# EAGLE design CTU (EAGLE 6.2)
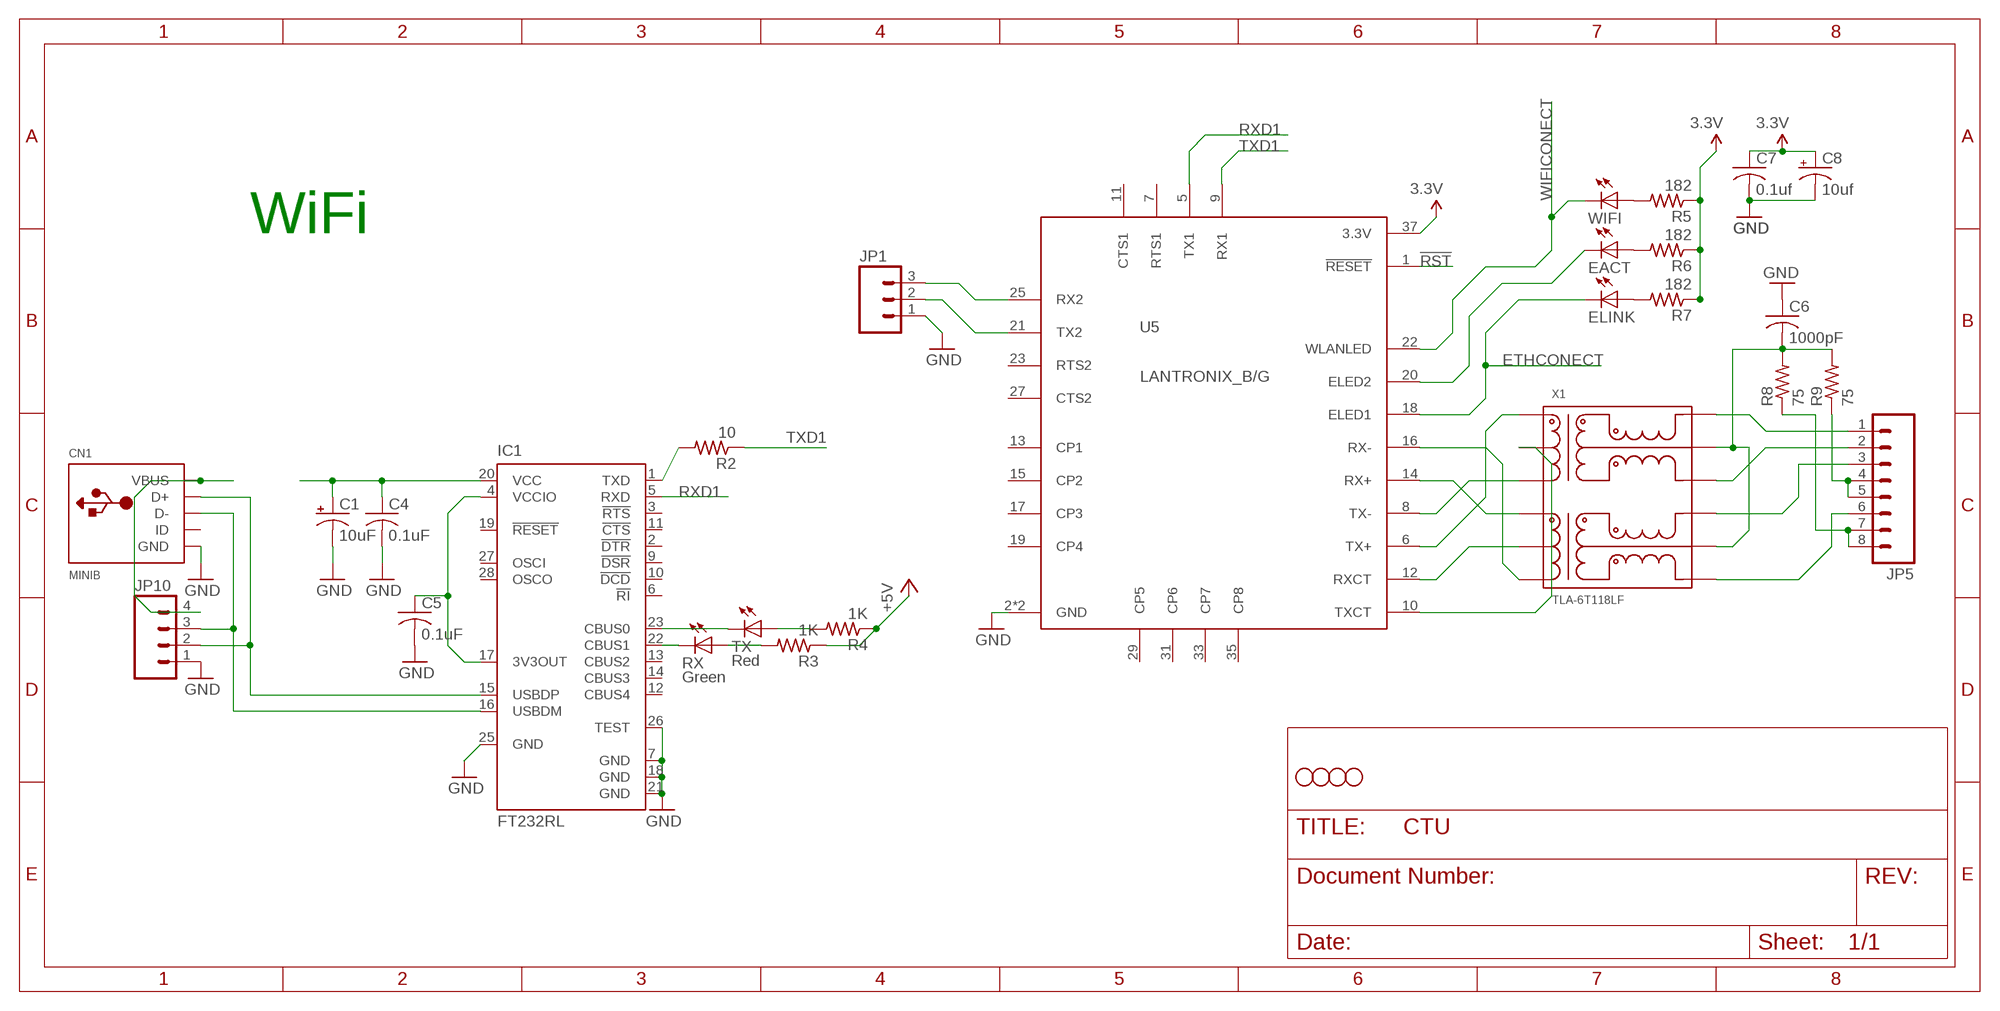
[diagram p0: schematic, sheet 1]

## Parts
C1  10uF  CAP_POL3528-KIT  [EIA3528-KIT]
C4  0.1uF  C-USC0805K  [C0805K]
C5  0.1uF  C-USC0805K  [C0805K]
C6  1000pF  C-USC1812  [C1812]
C7  0.1uf  C-USC0805K  [C0805K]
C8  10uf  CAP_POL3528  [EIA3528]
CN1  MINIB  USBMINIB  [USB-MINIB]
EACT  LEDCHIP-LED0805  [CHIP-LED0805]
ELINK  LEDCHIP-LED0805  [CHIP-LED0805]
IC1  FT232RL  [SSOP28]
JP1  M03POLAR  [MOLEX-1X3]
JP2  STAND-OFF  [STAND-OFF]
JP3  STAND-OFF  [STAND-OFF]
JP4  STAND-OFF  [STAND-OFF]
JP5  M08LOCK_LONGPADS  [1X08_LOCK_LONGPADS]
JP6  STAND-OFF  [STAND-OFF]
JP10  M04POLAR  [MOLEX-1X4]
R2  10  R-US_R0805  [R0805]
R3  1K  R-US_R0805  [R0805]
R4  1K  R-US_R0805  [R0805]
R5  182  R-US_R0805  [R0805]
R6  182  R-US_R0805  [R0805]
R7  182  R-US_R0805  [R0805]
R8  75  R-US_R0805  [R0805]
R9  75  R-US_R0805  [R0805]
RX  Green  LEDCHIP-LED0805  [CHIP-LED0805]
TX  Red  LEDCHIP-LED0805  [CHIP-LED0805]
U5  LANTRONIX_B/G  LANTRONIX_A/B  [LANA/BTH]
WIFI  LEDCHIP-LED0805  [CHIP-LED0805]
X1  TLA-6T118LF  [SO-16MOD]

## Nets
3.3V: C7.1 C8.A(+) R5.1 R6.1 R7.1 U5.37(3.3V)
!RST: U5.1(!RESET)
+5V: R3.1 R4.1
ETHCONECT: ELINK.C U5.18(ELED1)
GND: C1.C(-) C4.2 C5.2 C6.1 C7.2 C8.C(-) CN1.GND IC1.7(GND) IC1.18(GND) IC1.21(GND) IC1.25(GND) IC1.26(TEST) JP1.1 JP10.1 U5.2(GND) U5.39(GND)
N$1: JP1.2 U5.21(TX2)
N$2: JP1.3 U5.25(RX2)
N$3: C1.A(+) C4.1 IC1.20(VCC)
N$5: CN1.D+ IC1.15(USBDP) JP10.2
N$8: CN1.D- IC1.16(USBDM) JP10.3
N$22: IC1.23(CBUS0) TX.C
N$24: IC1.22(CBUS1) RX.C
N$30: R3.2 RX.A
N$31: R4.2 TX.A
N$32: IC1.1(TXD) R2.2
N$34: C5.1 IC1.4(VCCIO) IC1.17(3V3OUT)
N$53: U5.8(TX-) X1.3
N$54: U5.6(TX+) X1.1
N$55: U5.14(RX+) X1.6
N$56: U5.16(RX-) X1.8
N$57: U5.12(RXCT) X1.7
N$58: U5.10(TXCT) X1.2
N$59: JP5.4 JP5.5 R9.1
N$60: JP5.7 JP5.8 R8.1
N$61: JP5.6 X1.9
N$62: JP5.3 X1.11
N$63: JP5.2 X1.14
N$64: JP5.1 X1.16
N$65: C6.2 R8.2 R9.2 X1.10 X1.15
N$66: ELINK.A R7.2
N$67: EACT.A R6.2
N$68: R5.2 WIFI.A
N$70: EACT.C U5.20(ELED2)
RXD1: IC1.5(RXD) U5.5(TX1)
TXD1: R2.1 U5.9(RX1)
VBUS: CN1.VBUS JP10.4
WIFICONECT: U5.22(WLANLED) WIFI.C
Unconnected: CN1.ID IC1.2(!DTR) IC1.3(!RTS) IC1.6(!RI) IC1.9(!DSR) IC1.10(!DCD) IC1.11(!CTS) IC1.12(CBUS4) IC1.13(CBUS2) IC1.14(CBUS3) IC1.19(!RESET) IC1.27(OSCI) IC1.28(OSCO) U5.7(RTS1) U5.11(CTS1) U5.13(CP1) U5.15(CP2) U5.17(CP3) U5.19(CP4) U5.23(RTS2) U5.27(CTS2) U5.29(CP5) U5.31(CP6) U5.33(CP7) U5.35(CP8)

## Notes on the sheet
- WiFi

## Library data of the parts
C1 C8 = SparkFun:CAP_POL: Capacitor Polarized These are standard SMD and PTH capacitors. Normally 10uF, 47uF, and 100uF in electrolytic and tantalum varieties. Always verify the external diameter of the through hole cap, it varies with capacity, voltage, and manufacturer. The EIA devices should be standard.
C4-C7 = adafruit:C-US: CAPACITOR, American symbol
CN1 = adafruit:USB: USB Connectors USBMINIB - Surface Mount Female Mini-B USB Connector 4UConnector: 06564 By microbuilder.eu Thru-hole RA Female Mini-B USB Connector 4UConnector: 18732 By ladyada.net
EACT ELINK RX TX WIFI = adafruit:LED: LED OSRAM: - CHIPLED LG R971, LG N971, LY N971, LG Q971, LY Q971, LO R971, LY R971 LH N974, LH R974 LS Q976, LO Q976, LY Q976 LO Q996 - Hyper CHIPLED LW Q18S LB Q993, LB Q99A, LB R99A - SideLED LS A670, LO A670, LY A670, LG A670, LP A670 LB A673, LV A673, LT A673, LW A673 LH A674 LY A675 LS A676, LA A676, LO A676, LY A676, LW A676 LS A679, LY A679, LG A679 - Hyper Micro SIDELED® LS Y876, LA Y876, LO Y876, LY Y876 LT Y87S - SmartLED LW L88C, LW L88S LB L89C, LB L89S, LG L890 LS L89K, LO L89K, LY L89K LS L896, LA L896, LO L896, LY L896 - TOPLED LS T670, LO T670, LY T670, LG T670, LP T670 LSG T670, LSP T670, LSY T670, LOP T670, LYG T670 LG T671, LOG T671, LSG T671 LB T673, LV T673, LT T673, LW T673 LH T674 LS T676, LA T676, LO T676, LY T676, LB T676, LH T676, LSB T676, LW T676 LB T67C, LV T67C, LT T67C, LS T67K, LO T67K, LY T67K, LW E67C LS E67B, LA E67B, LO E67B, LY E67B, LB E67C, LV E67C, LT E67C LW T67C LS T679, LY T679, LG T679 LS T770, LO T770, LY T770, LG T770, LP T770 LB T773, LV T773, LT T773, LW T773 LH T774 LS E675, LA E675, LY E675, LS T675 LS T776, LA T776, LO T776, LY T776, LB T776 LHGB T686 LT T68C, LB T68C - Hyper Mini TOPLED® LB M676 - Mini TOPLED Santana® LG M470 LS M47K, LO M47K, LY M47K Source: http://www.osram.convergy.de/
IC1 = ftdichip:FT232R: Source: http://www.ftdichip.com/Documents/DataSheets/DS_FT232R_v104.pdf
JP1 = SparkFun:M03: Header 3 Standard 3-pin 0.1" header. Use with straight break away headers (SKU : PRT-00116), right angle break away headers (PRT-00553), swiss pins (PRT-00743), machine pins (PRT-00117), and female headers (PRT-00115). Molex polarized connector foot print use with SKU : PRT-08232 with associated crimp pins and housings.
JP2-JP4 JP6 = SparkFun:STAND-OFF: Stand Off This is the mechanical footprint for a #4 phillips button head screw. Use the keepout ring to avoid running the screw head into surrounding components. SKU : PRT-00447
JP5 = SparkFun:M08: Header 8 Standard 8-pin 0.1" header. Use with straight break away headers (SKU : PRT-00116), right angle break away headers (PRT-00553), swiss pins (PRT-00743), machine pins (PRT-00117), and female headers (PRT-00115).
JP10 = SparkFun:M04: Header 4 Standard 4-pin 0.1" header. Use with straight break away headers (SKU : PRT-00116), right angle break away headers (PRT-00553), swiss pins (PRT-00743), machine pins (PRT-00117), and female headers (PRT-00115). Molex polarized connector foot print use with SKU : PRT-08231 with associated crimp pins and housings. 1MM SMD Version SKU: PRT-10208
R2-R9 = adafruit:R-US_: RESISTOR, American symbol
U5 = NASA_LIB:LANTRONIX_A/B
X1 = NASA_LIB:TLA-6T118LF

## Board
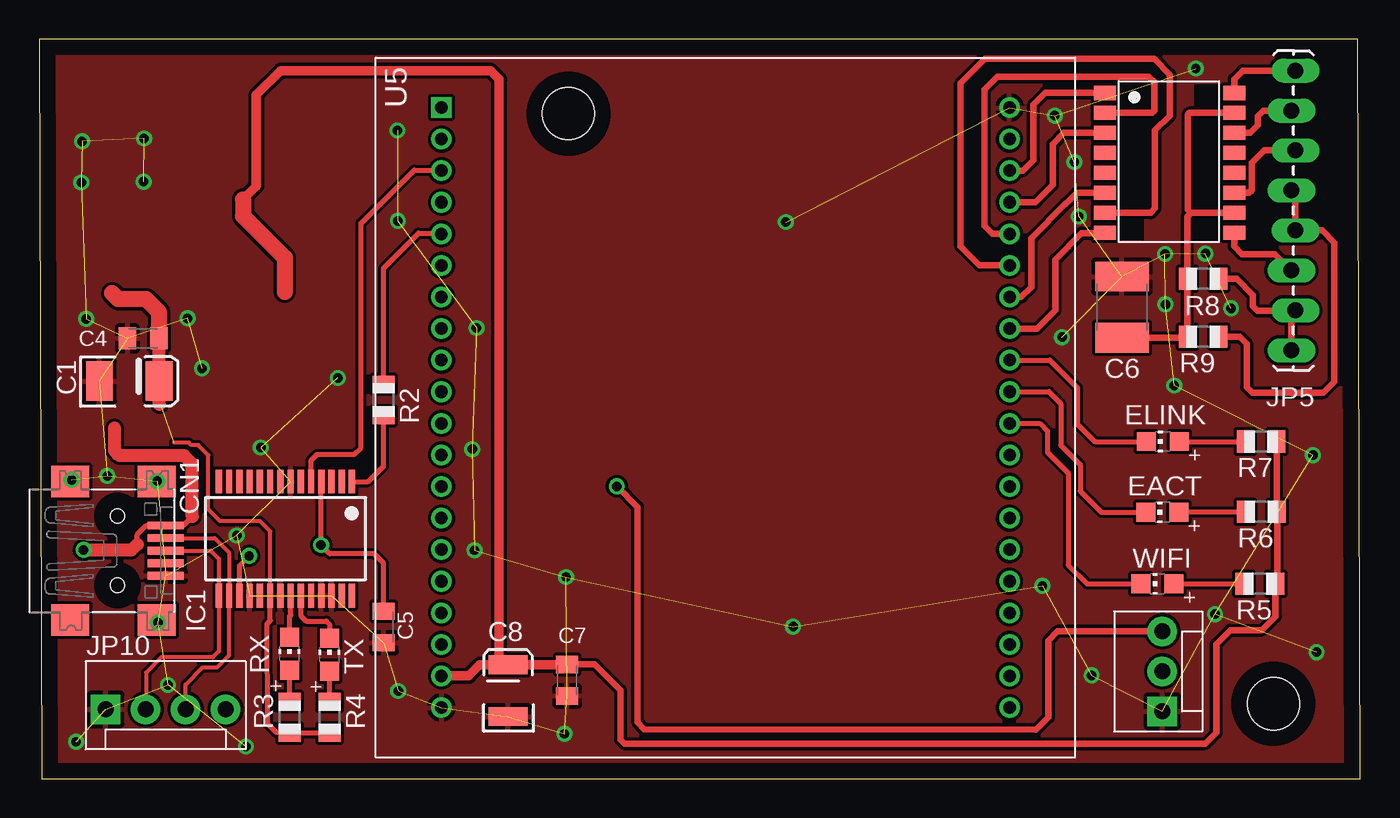
[diagram p1: board, top side]
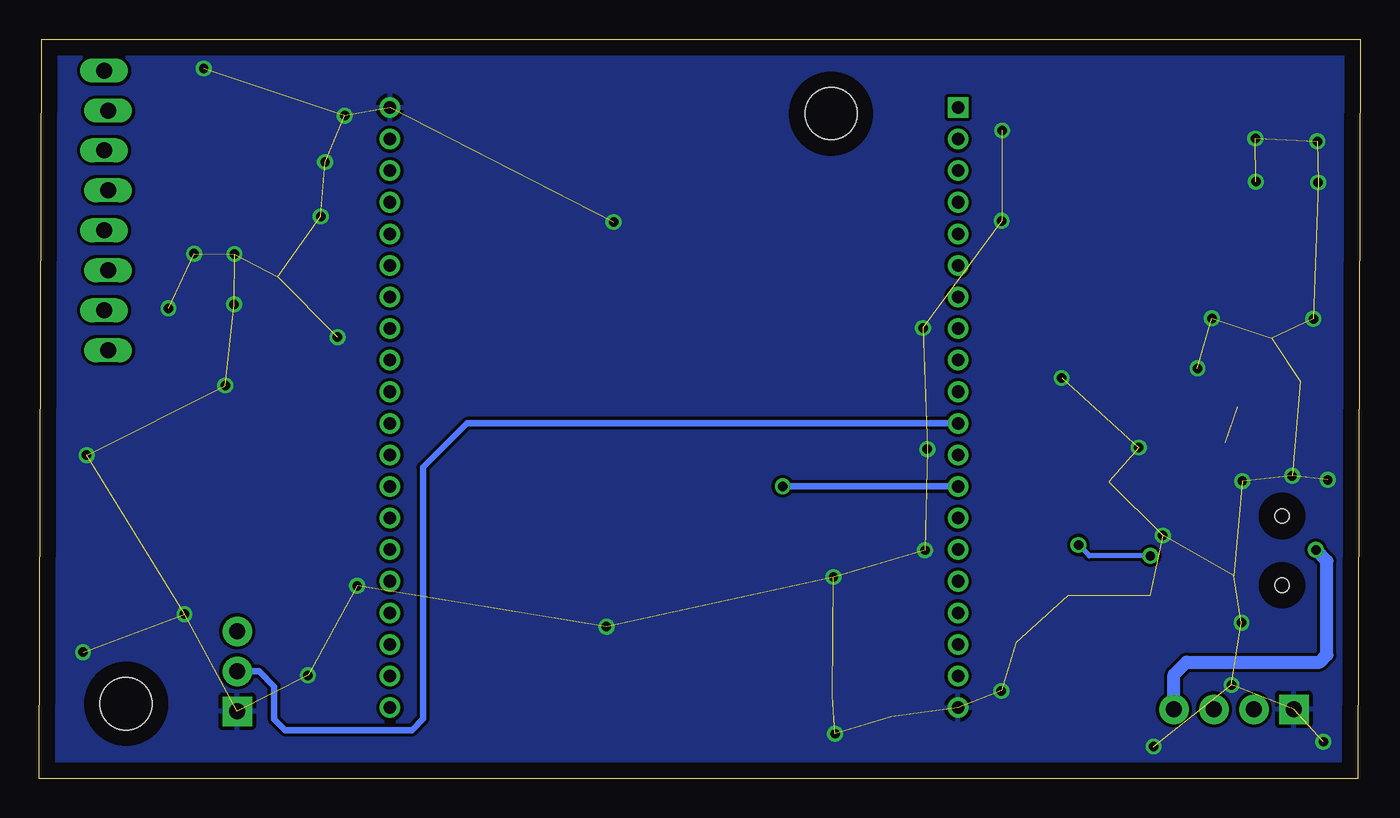
[diagram p2: board, bottom side, seen from below]

Size 83.95 x 46.96 mm. Coordinates in mm from the lower left corner, seen from the top.
Outline: 0.15,0 83.95,0 83.8,46.97 0,46.97 0.15,0
Copper layers (1*16): Top 0.035mm / dielectric 1.5mm / Bottom 0.035mm
Design rules: minimum track width 10mil, minimum drill 24mil, track to track 8mil, track to pad 8mil, pad to pad 8mil, via to via 8mil, smd to smd 8mil, copper to edge 40mil, drill to drill 8mil, minimum pad ring 10mil, minimum via ring 8mil, stop-mask expansion 4mil, vias tented up to drill 0mil, thermal gap 10mil

### Footprints (pad centres in the part's own frame; a part is rotated, then mirrored left to right if it is on the bottom)
EIA3528-KIT = smd 1.7 x 2.5: A 1.9,0; C -1.9,0
C0805K = smd 1.1 x 1.4: 1 -1,0; 2 1,0
C1812 = smd 1.9 x 3.4: 1 -1.95,0; 2 1.95,0
EIA3528 = smd 1.2 x 2.5: A 1.65,0; C -1.65,0
USB-MINIB = smd 0.5 x 2.308: D+ 0,4.064; D- -0.8,4.064; GND 1.6,4.064; ID 0.8,4.064; VBUS -1.6,4.064 | smd 2 x 2.4: GND1 -4.4,-2; GND2 -4.4,3.5; GND3 4.4,3.5; GND4 4.4,-2 | hole 0.9: -2.2,1; 2.2,1
CHIP-LED0805 = smd 1.2 x 1.2: A 0,-1.05; C 0,1.05
SSOP28 = smd 0.4 x 1.5: 1 -4.225,-3.625; 2 -3.575,-3.625; 3 -2.925,-3.625; 4 -2.275,-3.625; 5 -1.625,-3.625; 6 -0.975,-3.625; 7 -0.325,-3.625; 8 0.325,-3.625; 9 0.975,-3.625; 10 1.625,-3.625; 11 2.275,-3.625; 12 2.925,-3.625; 13 3.575,-3.625; 14 4.225,-3.625; 15 4.225,3.625; 16 3.575,3.625; 17 2.925,3.625; 18 2.275,3.625; 19 1.625,3.625; 20 0.975,3.625; 21 0.325,3.625; 22 -0.325,3.625; 23 -0.975,3.625; 24 -1.625,3.625; 25 -2.275,3.625; 26 -2.925,3.625; 27 -3.575,3.625; 28 -4.225,3.625
MOLEX-1X3 = drill 1.016 pad 1.88 square: 1 0,0 | drill 1.016 pad 1.88: 2 2.54,0; 3 5.08,0
STAND-OFF = hole 3.302: 0,0
1X08_LOCK_LONGPADS = drill 1.016 long: 1 0,0.127; 2 2.54,-0.127; 3 5.08,0.127; 4 7.62,-0.127; 5 10.16,0.127; 6 12.7,-0.127; 7 15.24,0.127; 8 17.78,-0.127
MOLEX-1X4 = drill 1.016 pad 1.88 square: 1 0,0 | drill 1.016 pad 1.88: 2 2.54,0; 3 5.08,0; 4 7.62,0
R0805 = smd 1.1 x 1.4: 1 -1,0; 2 1,0
LANA/BTH = drill 0.8 square: 1 -18.059,19.063 | drill 0.8: 2 18.059,19.063; 3 -18.059,17.056; 4 18.059,17.056; 5 -18.059,15.05; 6 18.059,15.05; 7 -18.059,13.043; 8 18.059,13.043; 9 -18.059,11.036; 10 18.059,11.036; 11 -18.059,9.03; 12 18.059,9.03; 13 -18.059,7.023; 14 18.059,7.023; 15 -18.059,5.016; 16 18.059,5.016; 17 -18.059,3.01; 18 18.059,3.01; 19 -18.059,1.003; 20 18.059,1.003; 21 -18.059,-1.003; 22 18.059,-1.003; 23 -18.059,-3.01; 24 18.059,-3.01; 25 -18.059,-5.016; 26 18.059,-5.016; 27 -18.059,-7.023; 28 18.059,-7.023; 29 -18.059,-9.03; 30 18.059,-9.03; 31 -18.059,-11.036; 32 18.059,-11.036; 33 -18.059,-13.043; 34 18.059,-13.043; 35 -18.059,-15.05; 36 18.059,-15.05; 37 -18.059,-17.056; 38 18.059,-17.056; 39 -18.059,-19.063; 40 18.059,-19.063
SO-16MOD = smd 1.4 x 0.9: 1 -4.11,4.445; 2 -4.11,3.175; 3 -4.11,1.905; 4 -4.11,0.635; 5 -4.11,-0.635; 6 -4.11,-1.905; 7 -4.11,-3.175; 8 -4.11,-4.445; 9 4.11,-4.445; 10 4.11,-3.175; 11 4.11,-1.905; 12 4.11,-0.635; 13 4.11,0.635; 14 4.11,1.905; 15 4.11,3.175; 16 4.11,4.445

### Placement (x,y rotation side)
C1  5.71,25.25 0 top
C4  6.6,27.97 180 top
C5  21.89,9.63 270 top
C6  68.81,29.95 270 top
C7  33.55,6.25 270 top
C8  29.79,5.59 90 top
CN1  3.96,14.48 270 top
EACT  71.37,16.92 90 top
ELINK  71.4,21.41 90 top
IC1  15.65,15.24 180 top
JP1  71.37,4.27 90 top
JP2  33.63,42.24 0 top
JP3  78.44,4.75 0 top
JP4  91.41,45.47 0 top  (outside the outline)
JP5  79.71,44.98 270 top
JP6  -4.24,45.09 0 top  (outside the outline)
JP10  4.22,4.39 0 top
R2  21.87,24.05 270 top
R3  15.9,3.89 90 top
R4  18.44,3.89 90 top
R5  77.57,12.37 180 top
R6  77.67,16.94 180 top
R7  77.65,21.41 180 top
R8  73.96,31.75 180 top
R9  73.96,28.07 180 top
RX  15.9,7.92 0 top
TX  18.44,7.87 0 top
U5  43.61,23.57 0 top
WIFI  71.07,12.37 90 top
X1  71.83,39.12 0 top

### Tracks (layer width: path | path; a pad name or v marks a point on that pad's centre or on a via)
3.3V
  Top 0.406: C7.1 35.3,7.25 36.93,5.61 36.93,2.46 37.19,2.21 74.12,2.21 74.8,2.9 74.8,8.53 75.69,9.42 77.7,9.42 78.56,10.29 R5.1 78.67,12.47 R6.1 78.65,16.97 R7.1
  Top 0.61: 27.99,7.21 28.02,7.24 C8.A 33.54,7.24 C7.1 | U5.37 27.29,6.51 27.99,7.21 | 27.99,7.21 29.11,7.21 29.24,7.34 29.24,44.42 28.68,44.98 15.34,44.98 13.79,43.43 13.79,37.64 12.95,36.8
  Top 1.016: 12.95,36.8 12.95,35.74 15.6,33.1 15.6,30.92
+5V
  Top 0.305: R4.1 R3.1 15.07,2.91 14.5,3.48 14.48,9.83 14.68,10.03 14.68,11.61
ETHCONECT
  Top 0.305: U5.18 64.22,26.58 65.99,24.82 65.99,22.5 67.08,21.41 ELINK.C
GND  (via drill 0.6)  (57 unrouted)
  other vias: 47.45,35.36 66.07,35.71 65.79,39.17 64.54,42.11 73.51,45.11 71.58,30.12 65,28.04 71.55,33.32 75.74,29.87 74.12,33.35 66.88,6.55 74.73,10.44 63.75,12.24 72.14,24.97 80.95,20.55 81.18,8.03 33.38,2.84 47.9,9.65 33.48,12.8 27.66,14.5 27.79,28.63 27.51,20.93 6.65,40.67 2.72,40.49 2.67,37.87 6.63,37.92 22.81,5.56 2.34,2.34 13.13,2.03 8.18,5.94 12.55,15.44 4.32,19.23 7.49,18.9 7.54,9.91 2.06,18.97 14.07,21.03 2.97,29.21 10.34,26.06 9.42,29.24 22.76,41.17 22.78,35.43 18.97,25.45
  pour Top: 0.18,-0.03 84.05,0.03 83.87,47.02 0,46.96
  pour Bottom: 0.15,0 83.95,0 83.92,46.96 0.13,46.96
N$1
  Bottom 0.406: U5.21 56.76,22.57 59.56,19.76 59.56,3.79 60.27,3.07 68.33,3.07 69.01,3.76 69.01,5.84 69.98,6.81 JP1.2
N$2  (via drill 0.6)
  Top 0.406: JP1.3 64.72,9.35 64.14,8.76 64.14,3.89 63.35,3.1 38.43,3.12 38.02,3.58 38.02,17.25 v36.7,18.57
  Bottom 0.406: v36.7,18.57 25.57,18.57 U5.25
N$3  (1 unrouted)
  Top 0.254: IC1.20 14.67,15.71 14.02,16.36 11.48,16.36 10.74,17.09 10.74,20.55 10.11,21.18 9.65,21.18 9.5,21.34 8.56,21.34
  Top 0.305: 7.77,23.62 7.62,23.77
  Top 0.813: 7.62,23.77 C1.A 7.62,27.95 C4.1
  Top 1.016: C4.1 7.6,29.63 6.78,30.45 5,30.45 4.62,30.84
N$5
  Top 0.254: CN1.D+ 10.9,14.48 11.4,13.97 11.4,11.63 | 11.4,11.63 IC1.15 | 11.4,11.63 11.4,8.08 11.02,7.7 7.75,7.7 6.78,6.73 6.78,4.93 JP10.2
N$8
  Top 0.254: CN1.D- 11.14,15.28 12.07,14.35 IC1.16 12.07,7.82 11.3,7.06 10.39,7.06 9.3,5.97 JP10.3
N$22
  Top 0.305: IC1.23 16.62,10.35 16.97,10.01 18.24,10.01 18.44,9.8 TX.C
N$24
  Top 0.305: RX.C 15.9,10.31 15.98,10.39 IC1.22
N$30
  Top 0.305: R3.2 RX.A
N$31
  Top 0.305: R4.2 TX.A
N$32
  Top 0.305: IC1.1 20.9,18.86 21.87,19.84 R2.2
N$34  (via drill 0.6)
  Top 0.305: IC1.17 12.72,13.53 v13.34,14.15 | IC1.4 17.91,18.85 v17.91,14.83 18.47,14.28 21.29,14.28 21.87,13.69 C5.1
  Bottom 0.305: v13.34,14.15 17.22,14.15 v17.91,14.83
N$53
  Top 0.406: U5.8 63.31,36.61 64.41,37.72 64.41,40.31 65.13,41.02 X1.3
N$54
  Top 0.406: U5.6 62.52,38.62 63.2,39.29 63.2,42.82 63.96,43.59 67.7,43.59 X1.1
N$55
  Top 0.406: U5.14 62.42,30.59 63.04,31.22 63.04,34.34 65.23,36.52 65.25,36.52 65.94,37.21 X1.6
N$56
  Top 0.406: U5.16 63.41,28.59 64.57,29.74 64.57,32.97 66.24,34.65 67.7,34.65 X1.8
N$57
  Top 0.406: U5.12 59.75,32.6 58.55,33.81 58.55,44.17 60.1,45.72 70.87,45.72 71.86,44.73 71.86,42.11 70.92,41.17 70.92,36.22 70.64,35.94 X1.7
N$58
  Top 0.406: U5.10 60.59,34.61 60.07,35.13 60.07,43.76 60.91,44.6 70.54,44.6 70.87,44.27 70.87,42.44 70.71,42.29 X1.2
N$59
  Top 0.406: R9.1 76.3,28.07 76.73,27.64 76.73,24.87 77.09,24.51 81.61,24.51 82.32,25.22 82.32,34.04 81.53,34.82 JP5.5 79.83,37.11 JP5.4
N$60
  Top 0.406: R8.1 76.1,31.75 77.14,30.71 77.14,30 77.42,29.72 79.81,29.72 JP5.7 79.58,29.49 JP5.8
N$61
  Top 0.406: X1.9 75.94,33.81 76.43,33.33 78.54,33.33 JP5.6
N$62
  Top 0.406: X1.11 76.89,37.21 77.06,37.39 77.06,39.12 77.85,39.9 JP5.3
N$63
  Top 0.406: X1.14 76.96,41.02 77.44,41.5 77.44,42.09 77.8,42.44 JP5.2
N$64
  Top 0.406: X1.16 75.94,44.45 76.48,44.98 JP5.1
N$65
  Top 0.406: C6.2 72.89,28 R9.2 R8.2 72.96,35.7 73.2,35.94 | 73.2,35.94 X1.10 | X1.15 73.1,42.29 73,42.19 73,36.14 73.2,35.94
N$66
  Top 0.305: ELINK.A R7.2
N$67
  Top 0.305: EACT.A 72.45,16.94 R6.2
N$68
  Top 0.305: WIFI.A R5.2
N$70
  Top 0.305: U5.20 64.17,24.57 64.92,23.82 64.92,21.18 66.17,19.94 66.17,18.26 67.51,16.92 EACT.C
RXD1
  Top 0.305: IC1.5 17.27,20.22 17.65,20.6 20.02,20.6 20.45,21.03 20.45,35.28 23.83,38.66 25.51,38.66 U5.5
TXD1
  Top 0.305: R2.1 21.87,32.41 24.1,34.65 25.51,34.65 U5.9
VBUS  (via drill 0.6)
  Top 0.254: 9.17,16.08 6.81,16.08
  Top 0.305: CN1.VBUS 9.17,16.08 9.73,16.64 | 6.22,14.88 6.22,15.52 6.81,16.08
  Top 0.813: 9.73,16.64 9.73,19.99 9.19,20.52 5.08,20.52 4.78,20.83 4.78,22.27 | v2.82,14.53 5.87,14.53 6.22,14.88
  Bottom 0.813: JP10.4 11.84,6.6 11.05,7.39 2.57,7.39 2.11,7.85 2.11,13.82 v2.82,14.53
WIFICONECT
  Top 0.305: U5.22 63.59,22.57 64.08,22.07 64.08,20.73 65.41,19.41 65.41,13.56 66.6,12.37 WIFI.C